# EAGLE design SparkFun_SOIC20_Adapter_v10 (EAGLE 7.2.0)
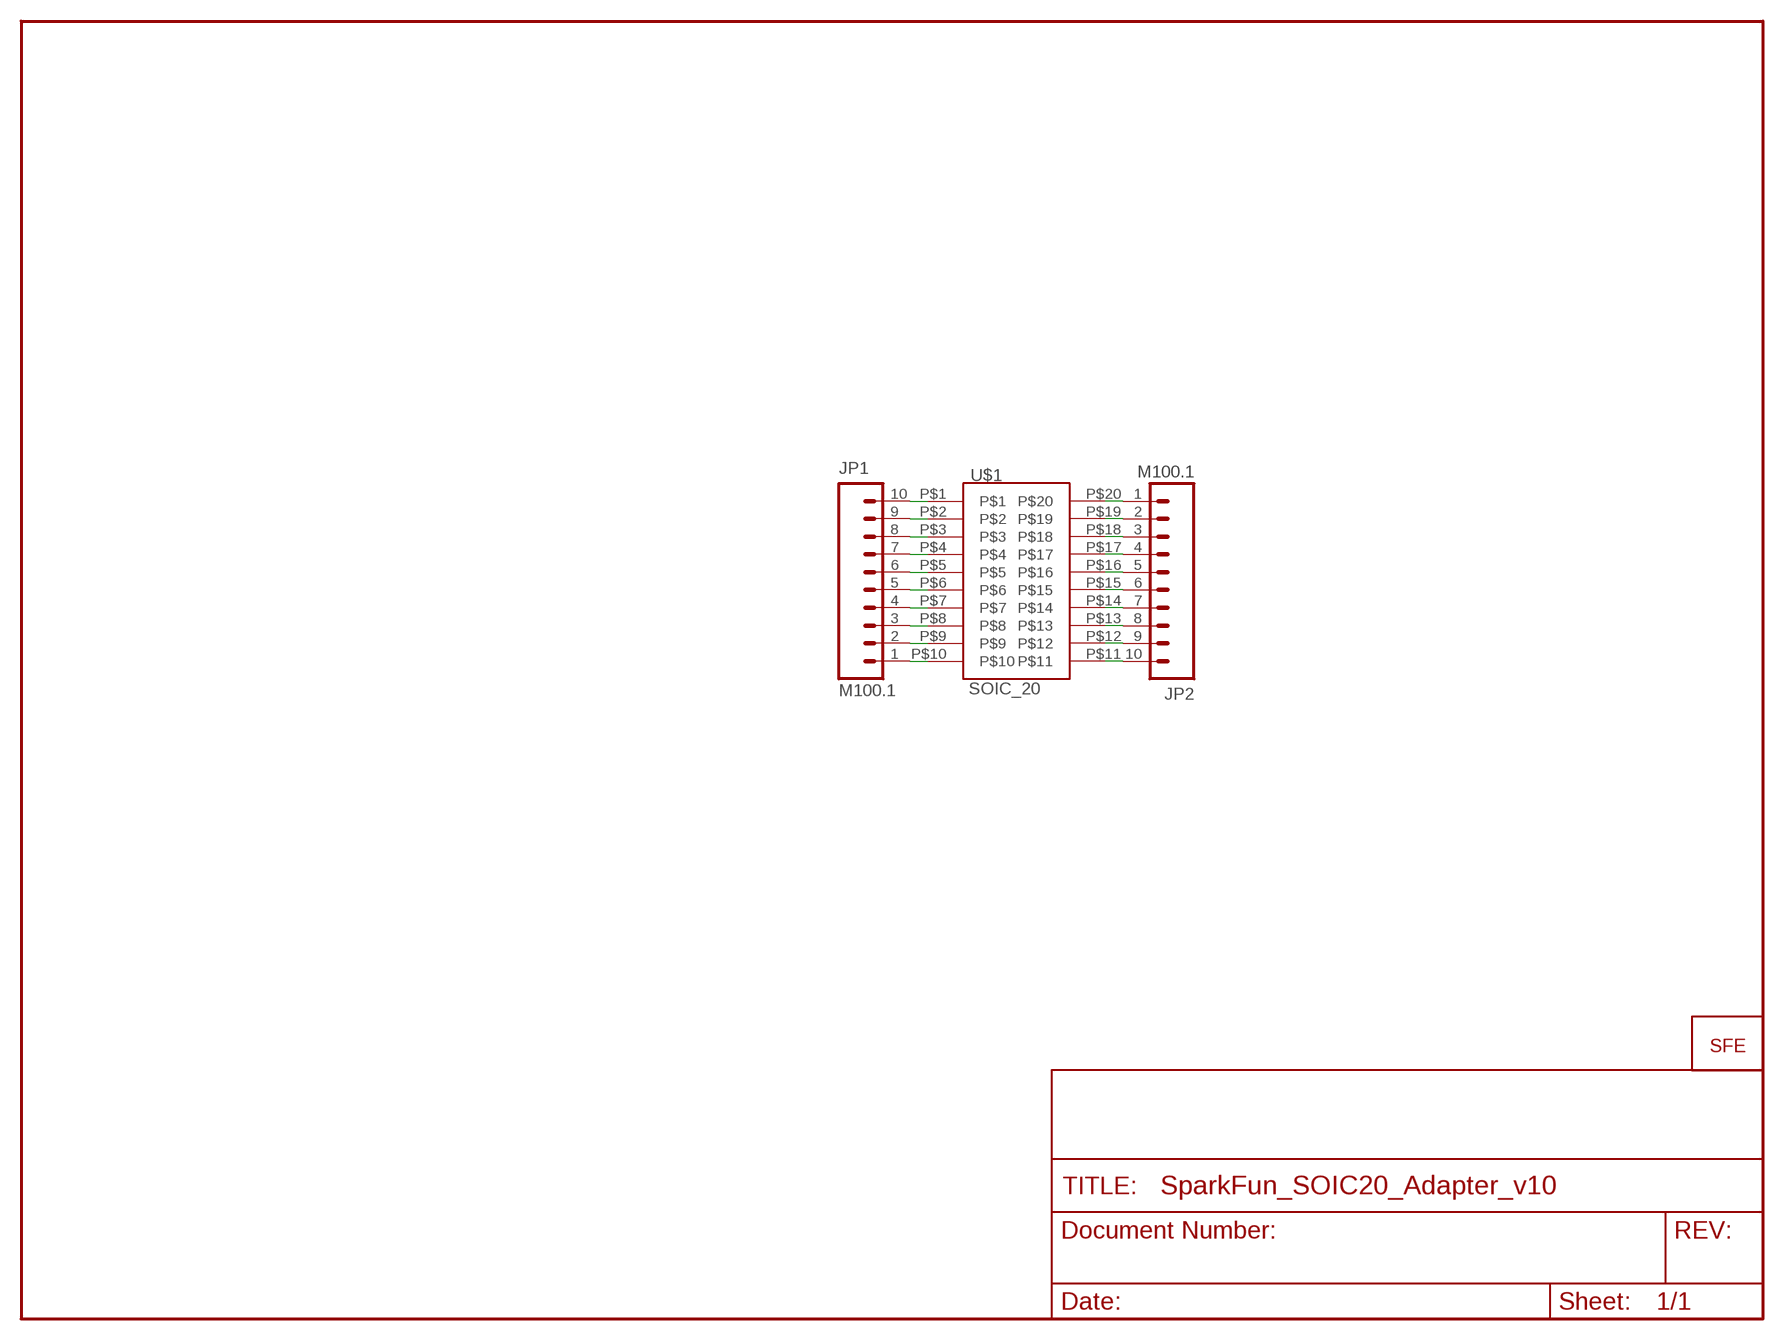
[diagram p0: schematic, sheet 1]

## Parts
JP1  M100.1  [1X10]
JP2  M100.1  [1X10]
U$1  SOIC_20  [SO20W]
U$2  LOGO-SFENEW  [SFE-NEW-WEBLOGO]

## Nets
N$1: JP1.1 U$1.P$10
N$2: JP1.2 U$1.P$9
N$3: JP1.3 U$1.P$8
N$4: JP1.4 U$1.P$7
N$5: JP1.5 U$1.P$6
N$6: JP1.6 U$1.P$5
N$7: JP1.7 U$1.P$4
N$8: JP1.8 U$1.P$3
N$9: JP1.9 U$1.P$2
N$10: JP1.10 U$1.P$1
N$11: JP2.1 U$1.P$20
N$12: JP2.2 U$1.P$19
N$13: JP2.3 U$1.P$18
N$14: JP2.4 U$1.P$17
N$15: JP2.5 U$1.P$16
N$16: JP2.6 U$1.P$15
N$17: JP2.7 U$1.P$14
N$18: JP2.8 U$1.P$13
N$19: JP2.9 U$1.P$12
N$20: JP2.10 U$1.P$11

## Library data of the parts
JP1 JP2 = SparkFun:M10: Header 10 Standard 10-pin 0.1" header. Use with straight break away headers (SKU : PRT-00116), right angle break away headers (PRT-00553), swiss pins (PRT-00743), machine pins (PRT-00117), and female headers (PRT-00115).
U$1 = SparkFun:SOIC_20
U$2 = SparkFun:LOGO-SFE: Spark Fun Electronics PCB Logo This is the standard Spark Fun Electronics PCB logo.

## Board
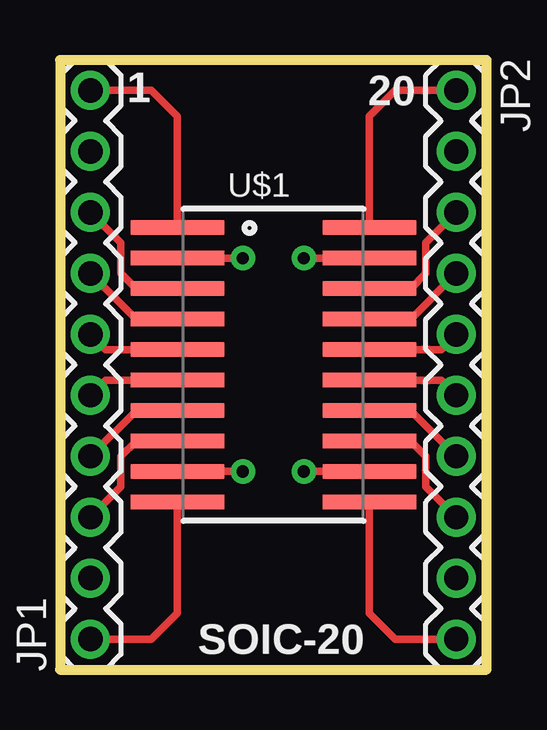
[diagram p1: board, top side]
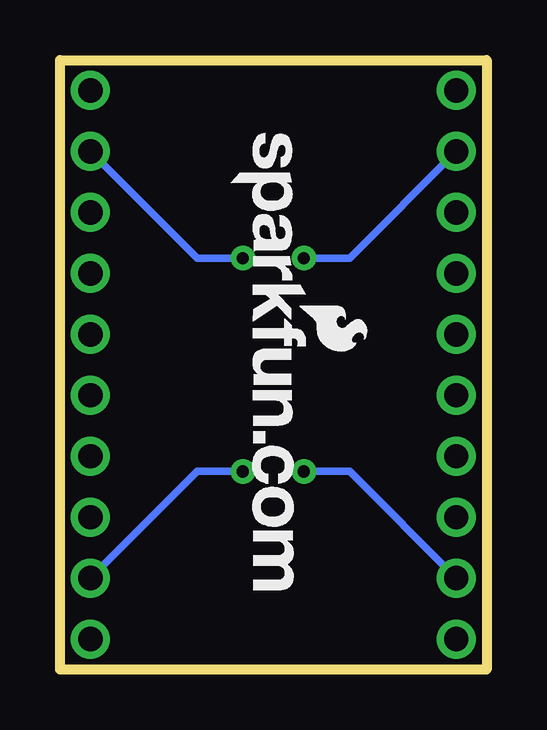
[diagram p2: board, bottom side, seen from below]

Size 17.78 x 25.4 mm. Coordinates in mm from the lower left corner, seen from the top.
Outline: 0,0 17.78,0 17.78,25.4 0,25.4 0,0
Copper layers (1*16): Top 0.035mm / dielectric 1.5mm / Bottom 0.035mm
Design rules "SparkFun": minimum track width 8mil, minimum drill 20mil, track to track 8mil, track to pad 8mil, pad to pad 8mil, via to via 8mil, smd to smd 8mil, copper to edge 10mil, drill to drill 8mil, minimum pad ring 12mil, minimum via ring 10mil, stop-mask expansion 4mil, vias tented up to drill 25mil, thermal gap 10mil

### Footprints (pad centres in the part's own frame; a part is rotated, then mirrored left to right if it is on the bottom)
1X10 = drill 1.016: 1 0,0; 2 2.54,0; 3 5.08,0; 4 7.62,0; 5 10.16,0; 6 12.7,0; 7 15.24,0; 8 17.78,0; 9 20.32,0; 10 22.86,0
SO20W = smd 0.6 x 3.9: P$1 -5.715,-4; P$2 -4.445,-4; P$3 -3.175,-4; P$4 -1.905,-4; P$5 -0.635,-4; P$6 0.635,-4; P$7 1.905,-4; P$8 3.175,-4; P$9 4.445,-4; P$10 5.715,-4; P$11 5.715,4; P$12 4.445,4; P$13 3.175,4; P$14 1.905,4; P$15 0.635,4; P$16 -0.635,4; P$17 -1.905,4; P$18 -3.175,4; P$19 -4.445,4; P$20 -5.715,4

### Placement (x,y rotation side)
JP1  1.27,1.27 90 top
JP2  16.51,24.13 270 top
U$1  8.89,12.7 270 top
U$2  10.67,22.35 270 bottom

### Tracks (layer width: path | path; a pad name or v marks a point on that pad's centre or on a via)
N$1
  Top 0.305: 3.81,1.27 4.39,1.85 | JP1.1 3.81,1.27 | U$1.P$10 4.89,2.35 3.81,1.27
N$2  (via drill 0.51)
  Top 0.305: U$1.P$9 v7.62,8.26
  Bottom 0.305: v7.62,8.26 5.71,8.26 JP1.2
N$3
  Top 0.305: U$1.P$8 3.17,9.53 2.54,8.89 2.54,7.62 JP1.3
N$4
  Top 0.305: U$1.P$7 3.17,10.79 JP1.4
N$5
  Top 0.305: U$1.P$6 1.91,12.06 JP1.5
N$6
  Top 0.305: U$1.P$5 1.91,13.34 JP1.6
N$7
  Top 0.305: U$1.P$4 3.17,14.61 JP1.7
N$8
  Top 0.305: U$1.P$3 3.17,15.88 2.54,16.51 2.54,17.78 JP1.8
N$9  (via drill 0.51)
  Top 0.305: U$1.P$2 v7.62,17.14
  Bottom 0.305: v7.62,17.14 5.71,17.14 JP1.9
N$10
  Top 0.305: 3.81,24.13 4.39,23.55 | 3.81,24.13 JP1.10 | U$1.P$1 4.89,23.05 3.81,24.13
N$11
  Top 0.305: 13.97,24.13 13.39,23.55 | 13.97,24.13 JP2.1 | U$1.P$20 12.89,23.05 13.97,24.13
N$12  (via drill 0.51)
  Top 0.305: U$1.P$19 v10.16,17.14
  Bottom 0.305: v10.16,17.14 12.06,17.14 JP2.2
N$13
  Top 0.305: U$1.P$18 14.61,15.88 15.24,16.51 15.24,17.78 JP2.3
N$14
  Top 0.305: U$1.P$17 14.61,14.61 JP2.4
N$15
  Top 0.305: U$1.P$16 15.88,13.34 JP2.5
N$16
  Top 0.305: U$1.P$15 15.88,12.06 JP2.6
N$17
  Top 0.305: U$1.P$14 14.61,10.79 JP2.7
N$18
  Top 0.305: U$1.P$13 14.61,9.53 15.24,8.89 15.24,7.62 JP2.8
N$19  (via drill 0.51)
  Top 0.305: U$1.P$12 v10.16,8.26
  Bottom 0.305: v10.16,8.26 12.06,8.26 JP2.9
N$20
  Top 0.305: 13.97,1.27 13.39,1.85 | 13.97,1.27 JP2.10 | U$1.P$11 12.89,2.35 13.97,1.27

### Text on the board
tPlace: 1 | 20 | SOIC-20
bDocu: SOIC-20